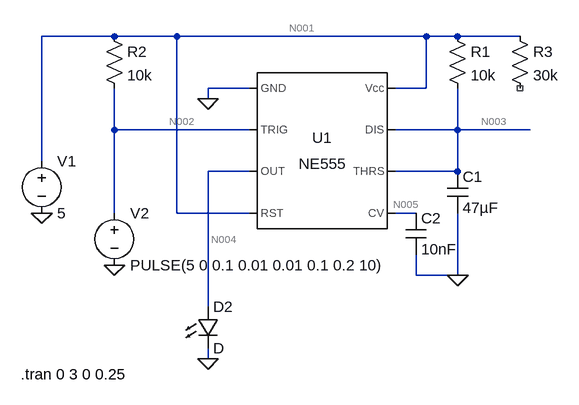
[diagram p0: schematic Draft6.asc]
Draft6.asc, the LTspice schematic file:
Version 4
SHEET 1 880 872
WIRE -240 336 -352 336
WIRE -144 336 -240 336
WIRE 240 336 -144 336
WIRE 288 336 240 336
WIRE 384 336 288 336
WIRE -32 416 -96 416
WIRE 240 416 240 336
WIRE 240 416 192 416
WIRE -96 432 -96 416
WIRE -240 480 -240 416
WIRE -32 480 -240 480
WIRE 288 480 288 416
WIRE 288 480 192 480
WIRE 400 480 288 480
WIRE -352 528 -352 336
WIRE -32 544 -96 544
WIRE 288 544 288 480
WIRE 288 544 192 544
WIRE -240 608 -240 480
WIRE -144 608 -144 336
WIRE -32 608 -144 608
WIRE 224 608 192 608
WIRE 224 704 224 672
WIRE 288 704 288 608
WIRE 288 704 224 704
WIRE -96 752 -96 544
WIRE -96 832 -96 816
FLAG -96 432 0
FLAG 288 704 0
FLAG -352 608 0
FLAG -240 688 0
FLAG -96 832 0
SYMBOL Misc\\NE555 80 512 R0
SYMATTR InstName U1
SYMBOL voltage -352 512 R0
WINDOW 123 0 0 Left 0
WINDOW 39 0 0 Left 0
SYMATTR InstName V1
SYMATTR Value 5
SYMBOL voltage -240 592 R0
WINDOW 123 0 0 Left 0
WINDOW 39 0 0 Left 0
SYMATTR InstName V2
SYMATTR Value PULSE(5 0 0.1 0.01 0.01 0.1 0.2 10)
SYMBOL res 272 320 R0
SYMATTR InstName R1
SYMATTR Value 10k
SYMBOL cap 272 544 R0
SYMATTR InstName C1
SYMATTR Value 47µF
SYMBOL cap 208 608 R0
SYMATTR InstName C2
SYMATTR Value 10nF
SYMBOL res -256 320 R0
SYMATTR InstName R2
SYMATTR Value 10k
SYMBOL LED -112 752 R0
SYMATTR InstName D2
SYMBOL res 368 320 R0
SYMATTR InstName R3
SYMATTR Value 30k
TEXT -384 856 Left 2 !.tran 0 3 0 0.25

The netlist it stands for:
* Draft6.asc
XU1 0 N002 N004 N001 N005 N003 N003 N001 NE555  ; pins GND TRIG OUT RST CV THRS DIS Vcc
V1 N001 0 5
V2 N002 0 PULSE(5 0 0.1 0.01 0.01 0.1 0.2 10)
R1 N001 N003 10k
C1 N003 0 47µF
C2 N005 0 10nF
R2 N001 N002 10k
D2 N004 0 D
R3 N001 NC_01 30k
.model D D
.lib standard.dio
.tran 0 3 0 0.25
.lib NE555.sub
.backanno
.end

* Results of the author's LTspice run, read from the files saved beside the schematic
* Operating Point, zero values left out:
*   V(n002) = 5 V
*   V(n005) = 3.333 V
*   V(n001) = 5 V
*   V(n003) = 5 V
*   V(n004) = 824.4 mV
*   I(D2) = 695.9 mA
*   I(R1) = 11.67 nA
*   I(V2) = -5 nA
*   I(V1) = -697.5 mA
*   Ix(u1:1) = -1.607 mA
*   Ix(u1:2) = 5 nA
*   Ix(u1:3) = -695.9 mA
*   Ix(u1:4) = 22.67 µA
*   Ix(u1:6) = 5 nA
*   Ix(u1:7) = 6.672 nA
*   Ix(u1:8) = 697.5 mA
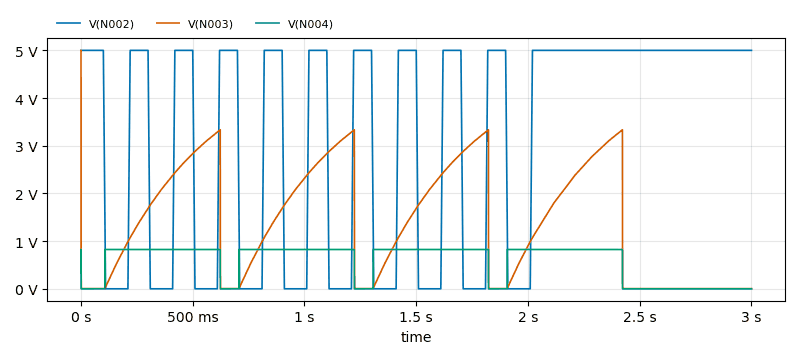
[diagram p1: Transient Analysis of Draft6.asc, plotted from the saved traces]
* Transient Analysis, 1 run:
*   V(N002): min 0 V, max 5 V, average 3.167 V, rms 3.974 V, last 5 V
*   V(N003): min 2.998 mV, max 5 V, average 1.355 V, rms 1.816 V, last 2.998 mV
*   V(N004): min 30 µV, max 824.4 mV, average 567.4 mV, rms 683.9 mV, last 30 µV